# EAGLE design Cansat2019_1516_Payload_SectionA_v04 (EAGLE 7.3.0)
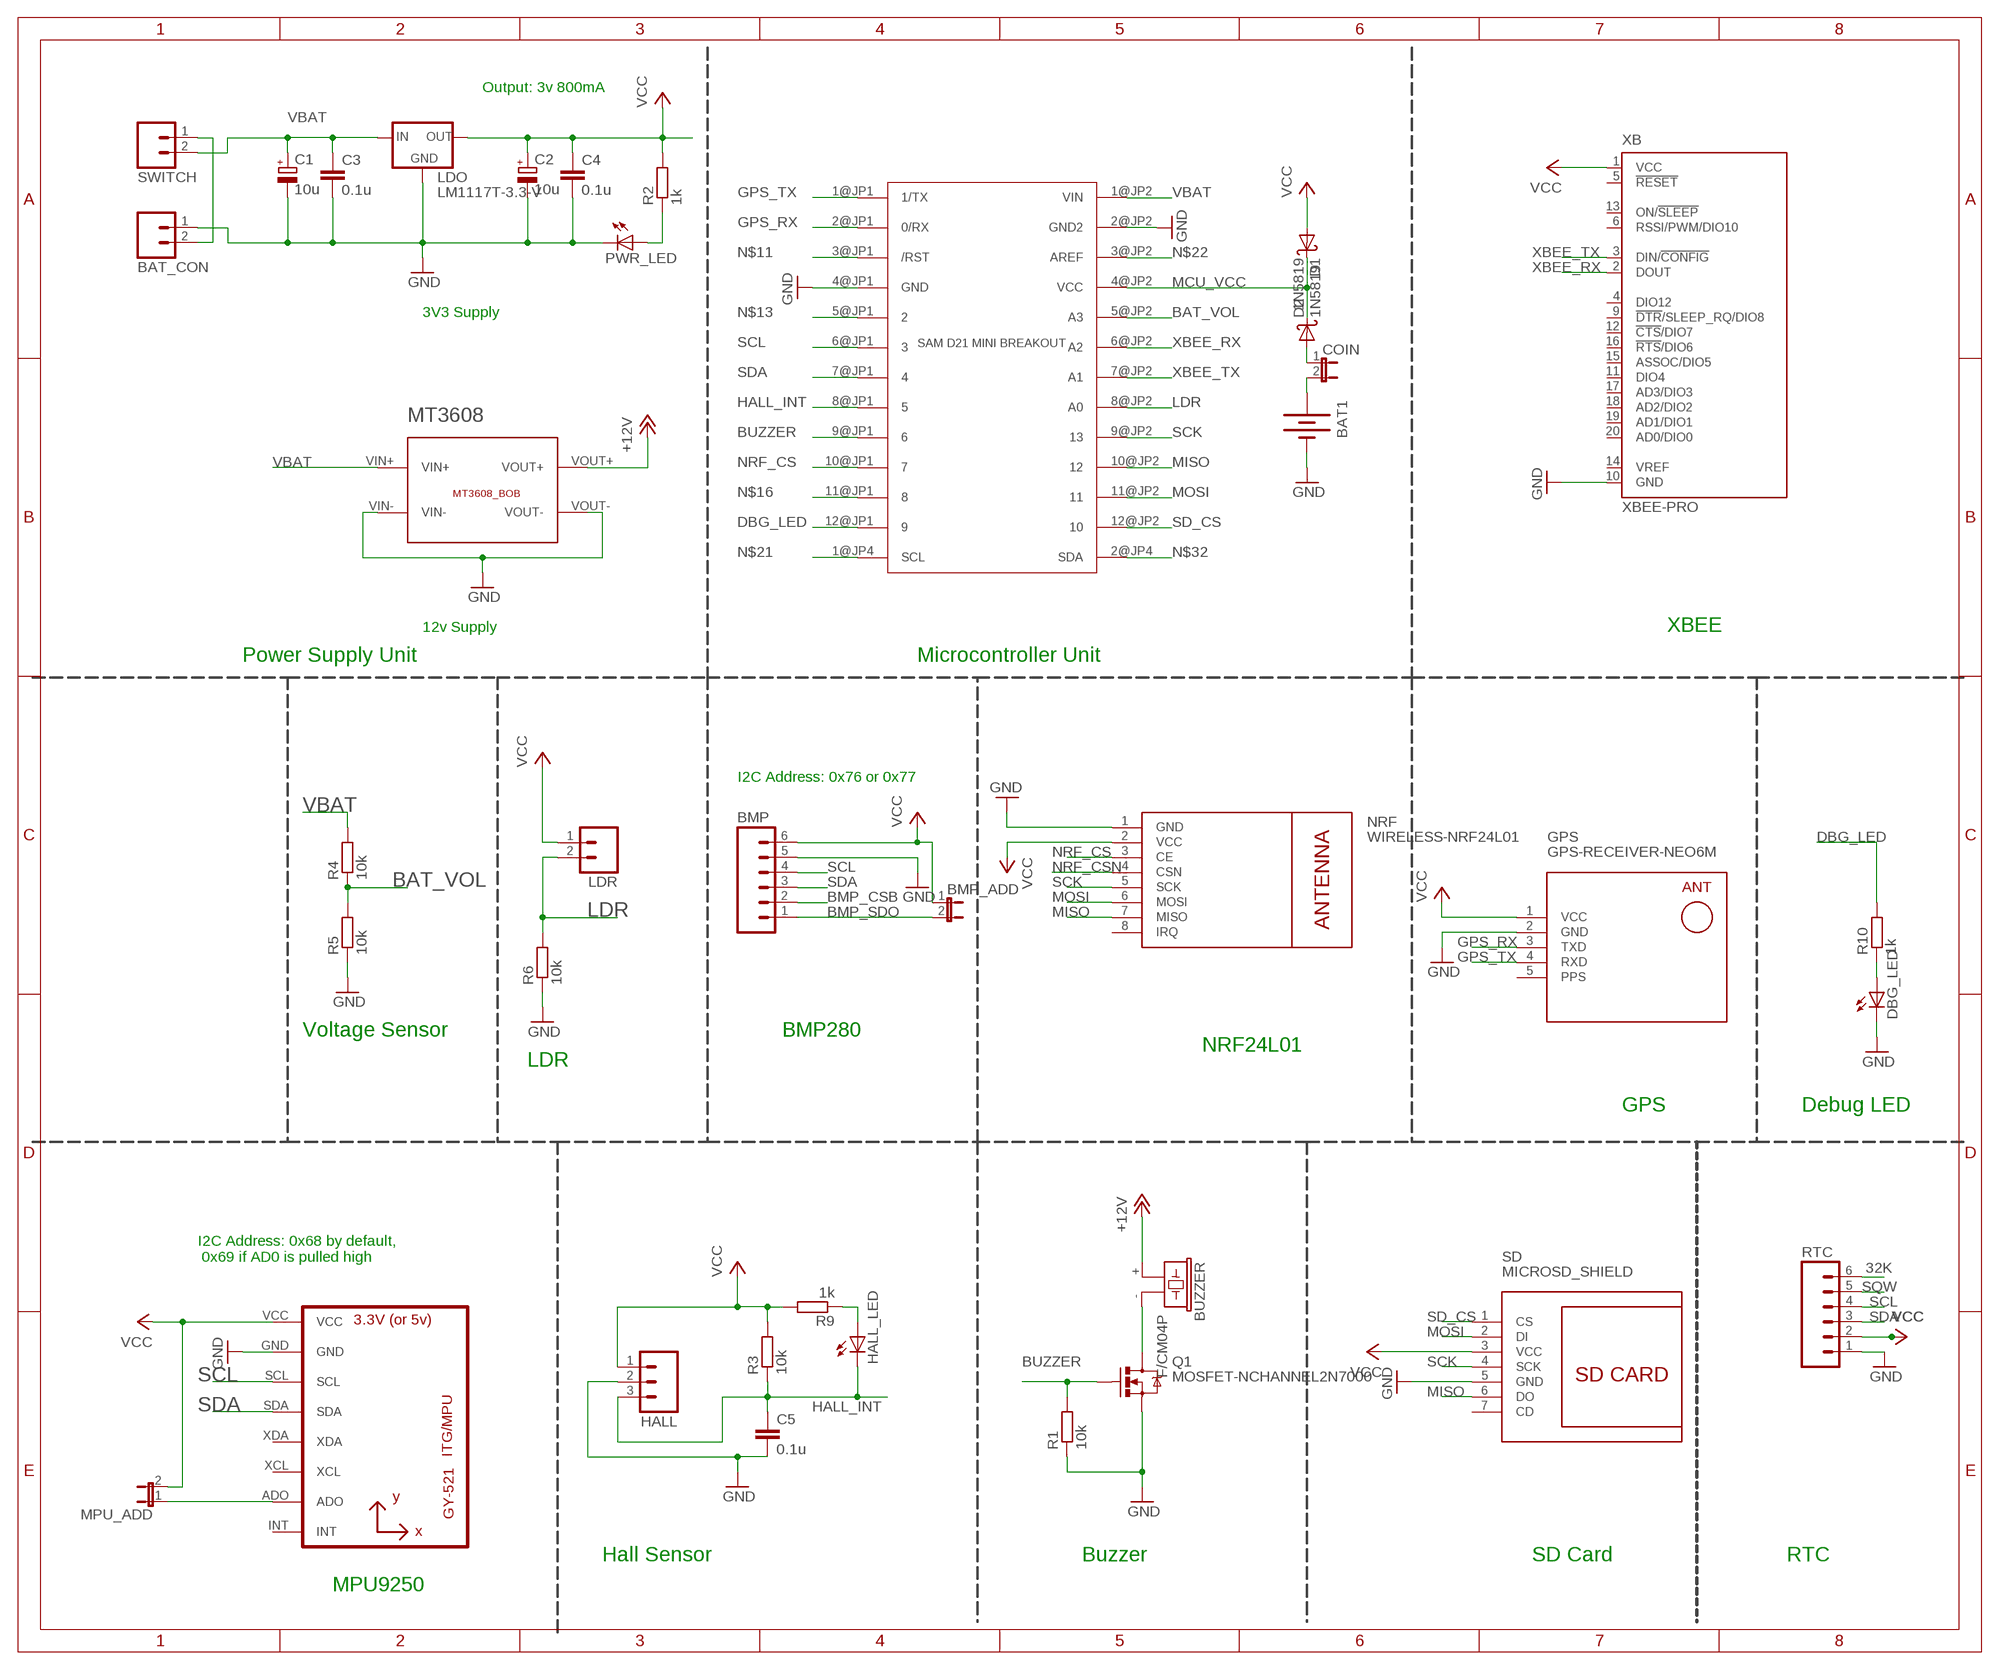
[diagram p0: schematic, sheet 1]

## Parts
BAT1  BATTERY20PTH  [BATTCOM_20MM_PTH]
BAT_CON  M02  [02P]
BMP  M06  [06P]
BMP_ADD  JUMPER-2PTH  [1X02]
BUZZER  F/CM04P  [F/CM04P]
C1  10u  CPOL-EUE2.5-6  [E2,5-6]
C2  10u  CPOL-EUE2.5-6  [E2,5-6]
C3  0.1u  C-EU025-025X050  [C025-025X050]
C4  0.1u  C-EU025-025X050  [C025-025X050]
C5  0.1u  C-EU025-025X050  [C025-025X050]
COIN  JUMPER-2PTH  [1X02]
D1  1N5819  [DO41-10]
D2  1N5819  [DO41-10]
DBG_LED  LED3MM  [LED3MM]
GPS  GPS-RECEIVER-NEO6M  [GPS-RECEIVER-NEO6M]
HALL  M03  [03P]
HALL_LED  LED3MM  [LED3MM]
LDO  LM1117T-3.3-V  [TO220V]
LDR  M02  [02P]
MPU  GY-521MPU6050  [GY-521]
MPU_ADD  JUMPER-2PTH  [1X02]
MT3608  MT3608_BOB  [MT3608_BOB]
NRF  WIRELESS-NRF24L01  [WIRELESS-NRF24L01]
PWR_LED  LED3MM  [LED3MM]
Q1  MOSFET-NCHANNEL2N7000  [TO-92]
R1  10k  R-EU_0204/7  [0204/7]
R2  1k  R-EU_0204/7  [0204/7]
R3  10k  R-EU_0204/7  [0204/7]
R4  10k  R-EU_0204/7  [0204/7]
R5  10k  R-EU_0204/7  [0204/7]
R6  10k  R-EU_0204/7  [0204/7]
R9  1k  R-EU_0204/7  [0204/7]
R10  1k  R-EU_0204/7  [0204/7]
RTC  M06  [06P]
SAMD  SAM_D21_MINI_BREAKOUT  [JP1_SPARKFUN-SAMD21-MINI-BREAKOUT-V10]
SD  MICROSD_SHIELD  [MICROSD_SHIELD]
SWITCH  M02  [02P]
XB  XBEE-PRO  [XBEE-PRO]

## Nets
32K: RTC.6
+12V [power]: BUZZER.+ MT3608.VOUT+
BAT_VOL: R4.1 R5.2 SAMD.5@JP2(A3)
BMP_CSB: BMP.2
BMP_SDO: BMP.1 BMP_ADD.2
BUZZER: Q1.2(G) R1.2 SAMD.9@JP1
DBG_LED: R10.2 SAMD.12@JP1
GND [power]: BAT1.2(-) BAT_CON.1 BMP.5 C1.- C2.- C3.2 C4.2 C5.2 DBG_LED.K(C) GPS.2(GND) HALL.2 LDO.1(GND) MPU.GND MT3608.VIN- MT3608.VOUT- NRF.1(GND) PWR_LED.K(C) Q1.1(S) R1.1 R5.1 R6.1 RTC.1 SAMD.2@JP2(GND2) SAMD.4@JP1(GND) SD.5(GND) XB.10(GND)
GPS_RX: GPS.3(TXD) SAMD.2@JP1(0/RX)
GPS_TX: GPS.4(RXD) SAMD.1@JP1(1/TX)
HALL_INT: C5.1 HALL.3 HALL_LED.K(C) R3.1 SAMD.8@JP1
LDR: LDR.2 R6.2 SAMD.8@JP2(A0)
MCU_VCC [power]: D1.C D2.C SAMD.4@JP2(VCC)
MISO: NRF.7(MISO) SAMD.10@JP2 SD.6(DO)
MOSI: NRF.6(MOSI) SAMD.11@JP2 SD.2(DI)
N$1: BUZZER.- Q1.3(D)
N$2 [power]: COIN.1 D2.A
N$3: PWR_LED.A R2.1
N$5 [power]: BAT1.1(+) COIN.2
N$6 [power]: BAT_CON.2 SWITCH.1
N$9: MPU.ADO MPU_ADD.1
N$11: SAMD.3@JP1(/RST)
N$13: SAMD.5@JP1
N$14: HALL_LED.A R9.1
N$15: DBG_LED.A R10.1
N$16: SAMD.11@JP1
N$21: SAMD.1@JP4(SCL)
N$22: SAMD.3@JP2(AREF)
N$32: SAMD.2@JP4(SDA)
NRF_CS: NRF.3(CE) SAMD.10@JP1
NRF_CSN: NRF.4(CSN)
SCK: NRF.5(SCK) SAMD.9@JP2 SD.4(SCK)
SCL: BMP.4 MPU.SCL RTC.4 SAMD.6@JP1
SD_CS: SAMD.12@JP2 SD.1(CS)
SDA: BMP.3 MPU.SDA RTC.3 SAMD.7@JP1
SQW: RTC.5
VBAT [power]: C1.+ C3.1 LDO.3(IN) MT3608.VIN+ R4.2 SAMD.1@JP2(VIN) SWITCH.2
VCC [power]: BMP.6 BMP_ADD.1 C2.+ C4.1 D1.A GPS.1(VCC) HALL.1 LDO.2(OUT) LDR.1 MPU.VCC MPU_ADD.2 NRF.2(VCC) R2.2 R3.2 R9.2 RTC.2 SD.3(VCC) XB.1(VCC)
XBEE_RX: SAMD.6@JP2(A2) XB.2(DOUT)
XBEE_TX: SAMD.7@JP2(A1) XB.3(DIN/!CONFIG)
Unconnected: MPU.INT MPU.XCL MPU.XDA NRF.8(IRQ) SD.7(CD) XB.4(DIO12) XB.5(!RESET) XB.6(RSSI/PWM/DIO10) XB.9(!DTR!/SLEEP_RQ/DIO8) XB.11(DIO4) XB.12(!CTS!/DIO7) XB.13(ON/!SLEEP) XB.14(VREF) XB.15(ASSOC/DIO5) XB.16(!RTS!/DIO6) XB.17(AD3/DIO3) XB.18(AD2/DIO2) XB.19(AD1/DIO1) XB.20(AD0/DIO0)

## Notes on the sheet
- Output: 3v 800mA
- 3V3 Supply
- 12v Supply | XBEE
- Power Supply Unit | Microcontroller Unit
- I2C Address: 0x76 or 0x77
- Voltage Sensor | BMP280
- NRF24L01
- LDR
- GPS | Debug LED
- I2C Address: 0x68 by default,
   0x69 if AD0 is pulled high
- Hall Sensor | Buzzer | SD Card | RTC
- MPU9250

## Power pins joined to a net without a drawn wire
PPS: GPS.5(PPS)

## Library data of the parts
BAT1 = MSP-MB_V12:BATTERY: Battery Holders Various common sizes : AA, AAA, 18650 (PRT-12895), 20mm coin cell and 12mm coin cell. 20MM_4LEGS, BATT-10373
BAT_CON LDR SWITCH = CEDT_JANUARY_2015_v5:M02: AMP QUICK CONNECTOR
BMP RTC = con-amp-quick:M06: AMP QUICK CONNECTOR; OC_FARNELL: unknown; OC_NEWARK: unknown
BMP_ADD COIN MPU_ADD = SparkFun-Retired:JUMPER-2: Jumper Basic 0.1" spaced jumper. Use with breakaway headers.
BUZZER = buzzer:F/CM04P: BUZZER Source: Buerklin; OC_FARNELL: unknown; OC_NEWARK: unknown
C1 C2 = rcl:CPOL-EU: POLARIZED CAPACITOR, European symbol
C3-C5 = rcl:C-EU: CAPACITOR, European symbol
D1 D2 = CEDT_JANUARY_2015_v6 (2):1N5819: DIODE general purpose rectifier, 1 A
DBG_LED HALL_LED PWR_LED = 01_adafruit:LED: LED OSRAM: - CHIPLED LG R971, LG N971, LY N971, LG Q971, LY Q971, LO R971, LY R971 LH N974, LH R974 LS Q976, LO Q976, LY Q976 LO Q996 - Hyper CHIPLED LW Q18S LB Q993, LB Q99A, LB R99A - SideLED LS A670, LO A670, LY A670, LG A670, LP A670 LB A673, LV A673, LT A673, LW A673 LH A674 LY A675 LS A676, LA A676, LO A676, LY A676, LW A676 LS A679, LY A679, LG A679 - Hyper Micro SIDELED® LS Y876, LA Y876, LO Y876, LY Y876 LT Y87S - SmartLED LW L88C, LW L88S LB L89C, LB L89S, LG L890 LS L89K, LO L89K, LY L89K LS L896, LA L896, LO L896, LY L896 - TOPLED LS T670, LO T670, LY T670, LG T670, LP T670 LSG T670, LSP T670, LSY T670, LOP T670, LYG T670 LG T671, LOG T671, LSG T671 LB T673, LV T673, LT T673, LW T673 LH T674 LS T676, LA T676, LO T676, LY T676, LB T676, LH T676, LSB T676, LW T676 LB T67C, LV T67C, LT T67C, LS T67K, LO T67K, LY T67K, LW E67C LS E67B, LA E67B, LO E67B, LY E67B, LB E67C, LV E67C, LT E67C LW T67C LS T679, LY T679, LG T679 LS T770, LO T770, LY T770, LG T770, LP T770 LB T773, LV T773, LT T773, LW T773 LH T774 LS E675, LA E675, LY E675, LS T675 LS T776, LA T776, LO T776, LY T776, LB T776 LHGB T686 LT T68C, LB T68C - Hyper Mini TOPLED® LB M676 - Mini TOPLED Santana® LG M470 LS M47K, LO M47K, LY M47K Source: http://www.osram.convergy.de/
GPS = diy-modules:GPS-RECEIVER-NEO6M: GPS Receiver Module based on NEO-6 device Short tutorial how to use NEO-6 module with Arduino: http://www.xarg.org/2016/06/neo6mv2-gps-module-with-arduino/ NEO-6 datasheet is available here: https://www.u-blox.com/sites/default/files/products/documents/NEO-6_DataSheet_%28GPS.G6-HW-09005%29.pdf Click here to find device on ebay.com <http://www.ebay.com/sch/gyneo6mv2>
HALL = msp framework:M03: AMP QUICK CONNECTOR
LDO = lm1117:LM1117T-*
MPU = gy-521:GY-521
MT3608 = Breakouts:MT3608_BOB
NRF = diy-modules:WIRELESS-NRF24L01: 2.4 GHz Wireless Module based on NRF24L01 chip More details available here: http://www.electrodragon.com/w/NRF24L01 Click here to find device on ebay.com <http://www.ebay.com/sch/nrf24l01+arduino>
Q1 = SparkFun-DiscreteSemi:MOSFET-NCHANNEL: Common NMOSFET Parts MFG P/N Store ID Prod ID FDD8780 TRANS-09984 SI7820DN TRANS-11055 FDS6630A IC-08089 2N7002PW TRANS-11151 FQP30N06L COM-10213 TRANS-10060 BSS123LT1G TRANS-08345 BSS138 TRANS-00830 BS170 2N7000
R1-R6 R9 R10 = rcl:R-EU_: RESISTOR, European symbol
SAMD = SparkFun-SAMD21-Mini-Breakout:SAM_D21_MINI_BREAKOUT: SPARKFUN-SAMD21-MINI-BREAKOUT
SD = Breakouts:MICROSD_SHIELD
XB = xbee:XBEE: XBee (TM) /XBee-PRO(TM) OEM RF Modules Source: MaxStream, Inc. xbee_productmanual.pdf; MPN: XBP24-AWI-001; OC_FARNELL: 1337916; OC_NEWARK: 42M2667

## Net classes
0 default: width 0.305 mm
1 power: width 0.61 mm, clearance 0.305 mm

## Board
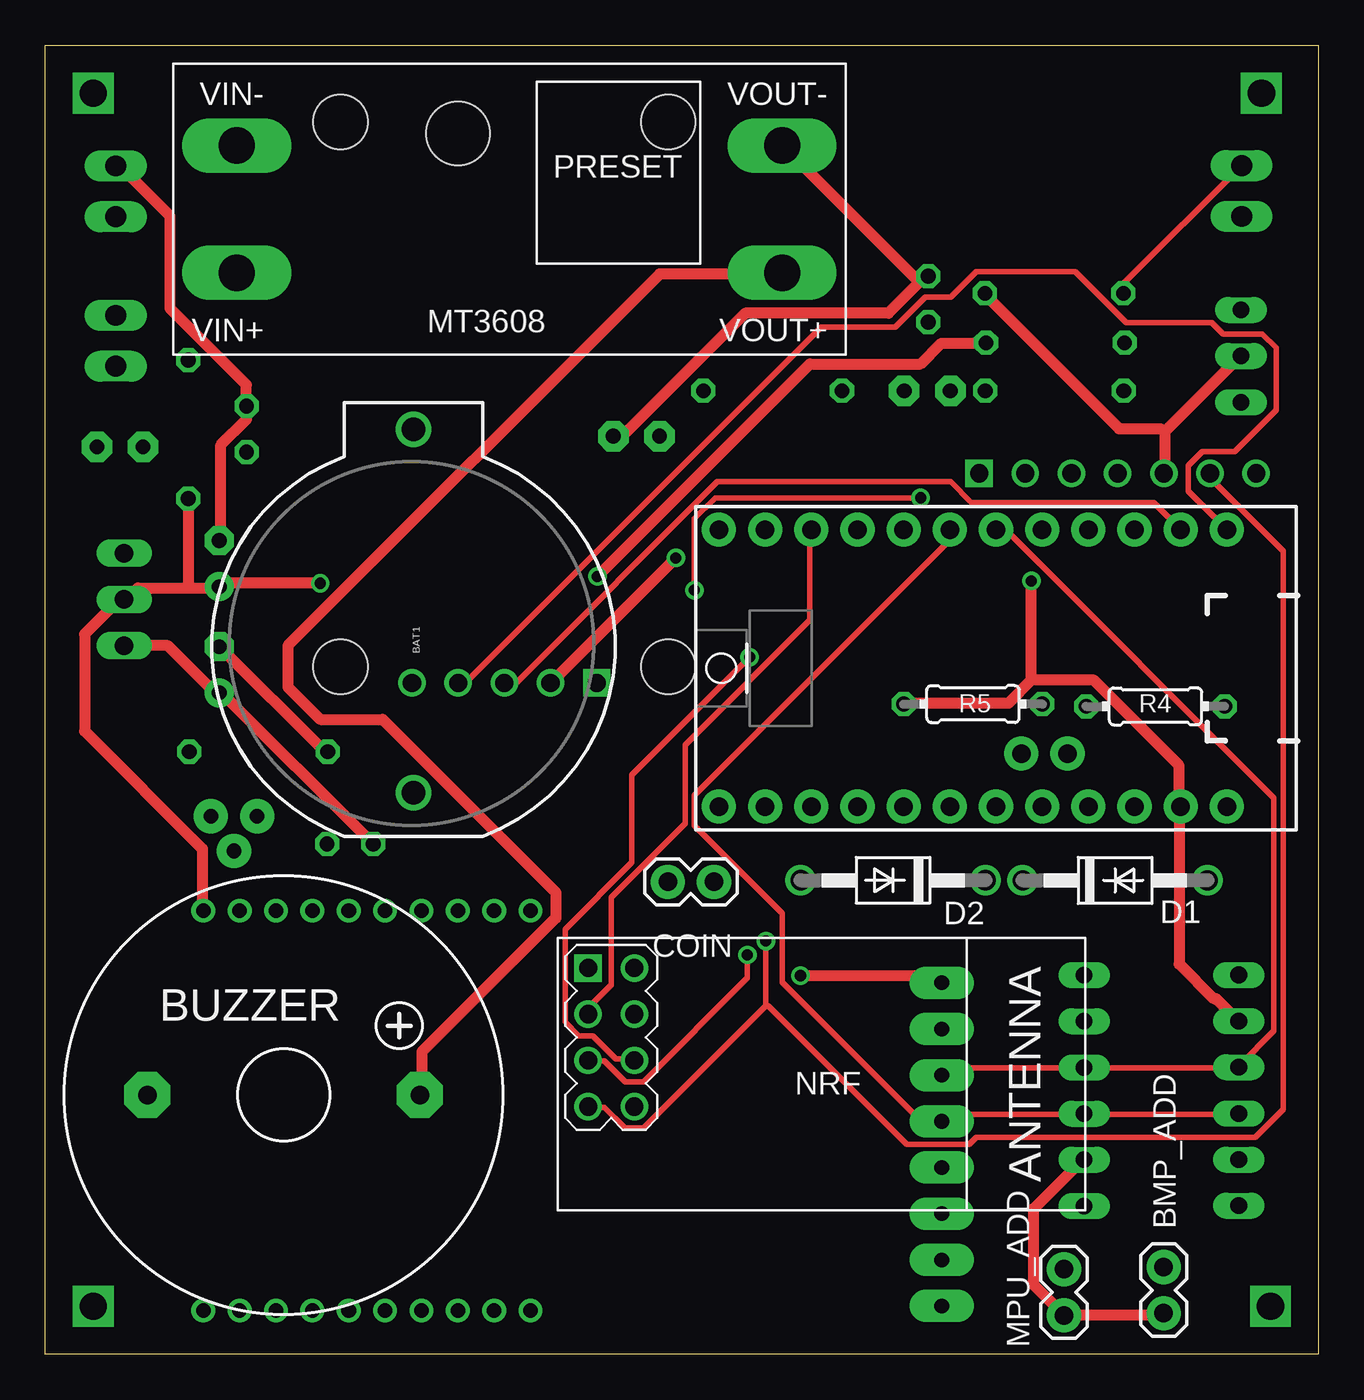
[diagram p1: board, top side]
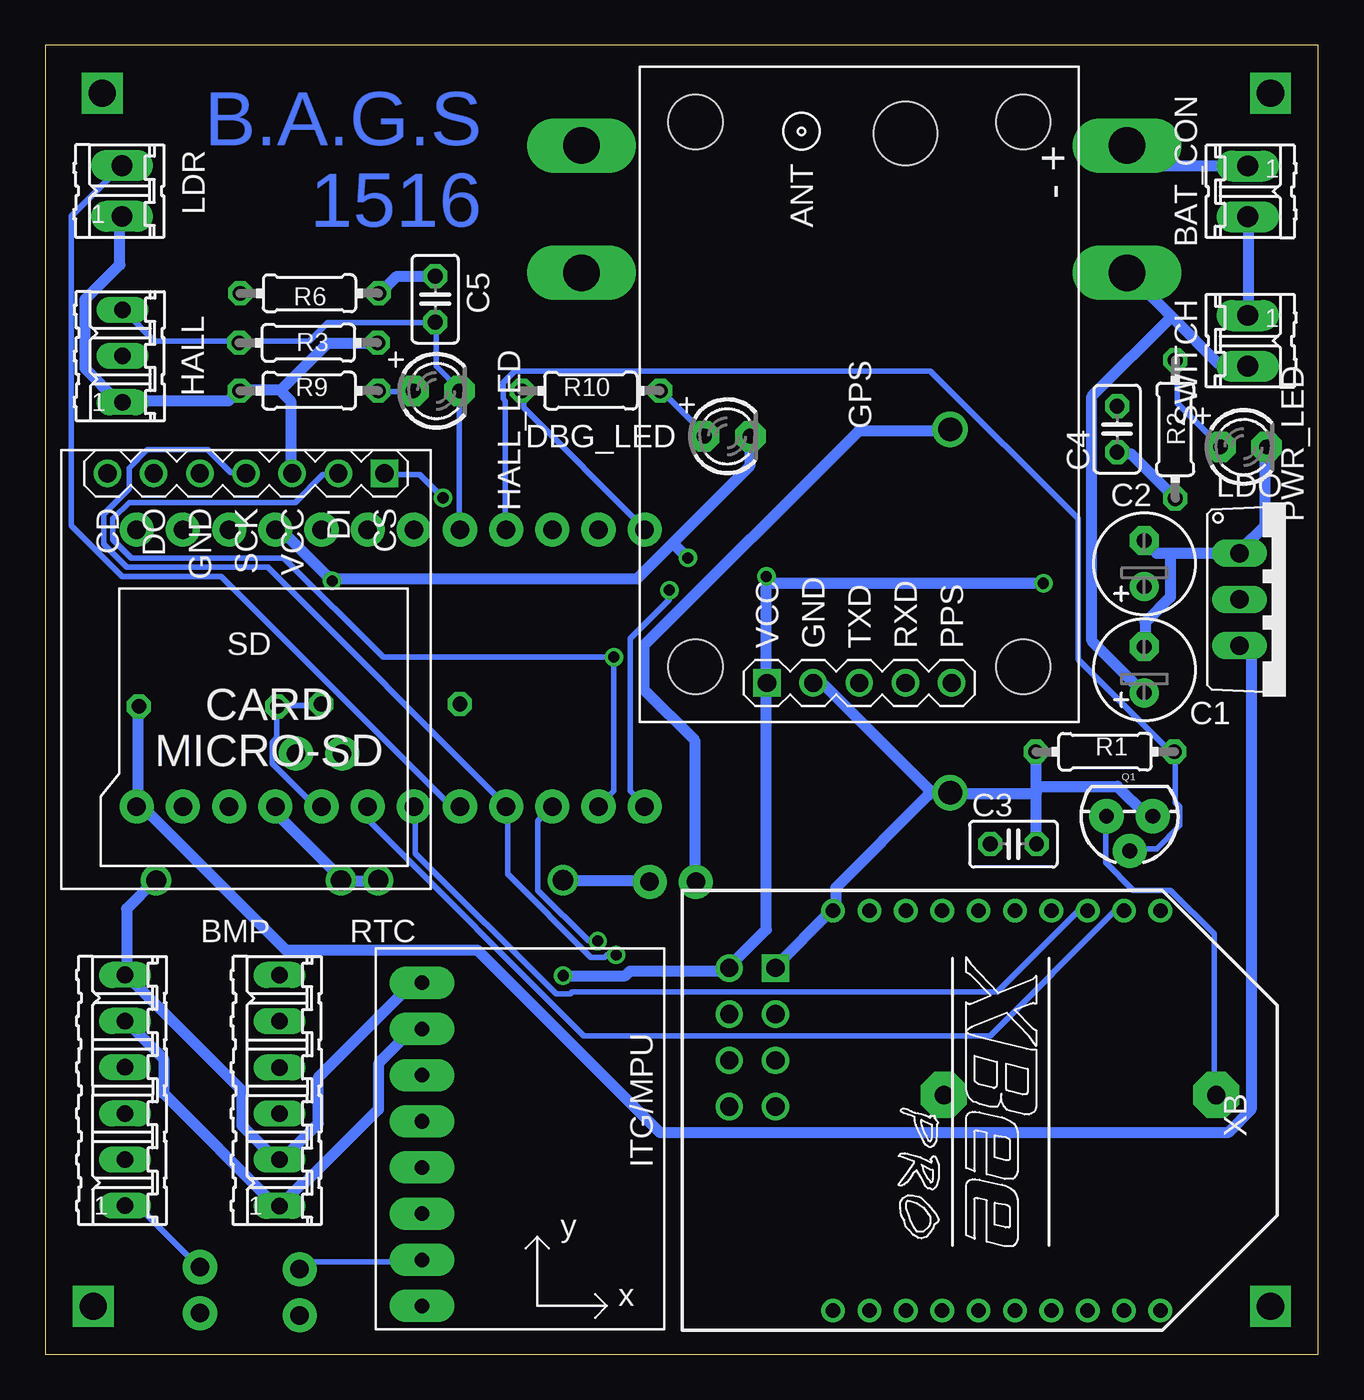
[diagram p2: board, bottom side, seen from below]

Size 70 x 72 mm. Coordinates in mm from the lower left corner, seen from the top.
Outline: 70,0 0,0 0,72 70,72 70,0
Copper layers (1*16): Top 0.035mm / dielectric 1.5mm / Bottom 0.035mm
Design rules "default": minimum track width 10mil, minimum drill 24mil, track to track 8mil, track to pad 8mil, pad to pad 8mil, via to via 8mil, smd to smd 8mil, copper to edge 40mil, drill to drill 8mil, minimum pad ring 10mil, minimum via ring 8mil, stop-mask expansion 4mil, vias tented up to drill 0mil, thermal gap 10mil

### Footprints (pad centres in the part's own frame; a part is rotated, then mirrored left to right if it is on the bottom)
BATTCOM_20MM_PTH = drill 1.3: 1 11.85,0; 2 -8.15,0
02P = drill 1.143 long: 1 -1.397,0; 2 1.397,0
06P = drill 0.914 long: 1 -6.35,0; 2 -3.81,0; 3 -1.27,0; 4 1.27,0; 5 3.81,0; 6 6.35,0
1X02 = drill 1.016 pad 1.88: 1 0,0; 2 2.54,0
F/CM04P = drill 1.016 pad 2.54 octagon: + 7.493,0; - -7.493,0
E2,5-6 = drill 0.813 pad 1.6: + -1.27,0 | drill 0.813 pad 1.6 octagon: - 1.27,0
C025-025X050 = drill 0.813 octagon: 1 -1.27,0; 2 1.27,0
DO41-10 = drill 1.118: A 5.08,0; C -5.08,0
LED3MM = drill 0.813 pad 1.676 octagon: A -1.27,0; K 1.27,0
GPS-RECEIVER-NEO6M = drill 1 square: 1 -15.875,5.08 | drill 1: 2 -15.875,2.54; 3 -15.875,0; 4 -15.875,-2.54; 5 -15.875,-5.08 | hole 3: -14.986,9.017; -14.986,-9.017; 14.986,-9.017; 14.986,9.017 | hole 3.5: 14.351,-2.54
03P = drill 0.914 long: 1 -2.54,0; 2 0,0; 3 2.54,0
TO220V = drill 1.016 long: 1 -2.54,-2.54; 2 0,-2.54; 3 2.54,-2.54
GY-521 = drill 0.8 pad 1.778 long: ADO -8.89,-6.35; GND -8.89,6.35; INT -8.89,-8.89; SCL -8.89,3.81; SDA -8.89,1.27; VCC -8.89,8.89; XCL -8.89,-3.81; XDA -8.89,-1.27
MT3608_BOB = drill 2 pad 3 long: VIN+ 33.5,-4.5; VIN- 33.5,-11.5; VOUT+ 3.5,-4.5; VOUT- 3.5,-11.5
WIRELESS-NRF24L01 = drill 1 square: 1 -12.7,6.35 | drill 1: 2 -10.16,6.35; 3 -12.7,3.81; 4 -10.16,3.81; 5 -12.7,1.27; 6 -10.16,1.27; 7 -12.7,-1.27; 8 -10.16,-1.27
TO-92 = drill 0.813 pad 1.88: 1 -1.27,0; 2 0,1.905; 3 1.27,0
0204/7 = drill 0.813 octagon: 1 -3.81,0; 2 3.81,0
JP1_SPARKFUN-SAMD21-MINI-BREAKOUT-V10 = drill 1.016 pad 1.88: 1@JP1 1.27,29.21; 1@JP2 16.51,29.21; 1@JP4 13.589,20.447; 2@JP1 1.27,26.67; 2@JP2 16.51,26.67; 2@JP4 13.589,17.907; 3@JP1 1.27,24.13; 3@JP2 16.51,24.13; 4@JP1 1.27,21.59; 4@JP2 16.51,21.59; 5@JP1 1.27,19.05; 5@JP2 16.51,19.05; 6@JP1 1.27,16.51; 6@JP2 16.51,16.51; 7@JP1 1.27,13.97; 7@JP2 16.51,13.97; 8@JP1 1.27,11.43; 8@JP2 16.51,11.43; 9@JP1 1.27,8.89; 9@JP2 16.51,8.89; 10@JP1 1.27,6.35; 10@JP2 16.51,6.35; 11@JP1 1.27,3.81; 11@JP2 16.51,3.81; 12@JP1 1.27,1.27; 12@JP2 16.51,1.27
MICROSD_SHIELD = drill 1 square: 1 1.27,17.78 | drill 1: 2 1.27,15.24; 3 1.27,12.7; 4 1.27,10.16; 5 1.27,7.62; 6 1.27,5.08; 7 1.27,2.54
XBEE-PRO = drill 0.8 pad 1.27: 1 -11,9; 2 -11,7; 3 -11,5; 4 -11,3; 5 -11,1; 6 -11,-1; 7 -11,-3; 8 -11,-5; 9 -11,-7; 10 -11,-9; 11 11,-9; 12 11,-7; 13 11,-5; 14 11,-3; 15 11,-1; 16 11,1; 17 11,3; 18 11,5; 19 11,7; 20 11,9

### Placement (x,y rotation side)
BAT1  20.24,39.03 90 top
BAT_CON  3.87,63.97 270 bottom
BMP  65.63,14.51 90 bottom
BMP_ADD  61.5,2.25 90 top
BUZZER  13.1,14.26 0 top
C1  9.56,37.65 90 bottom
C2  9.56,43.49 90 bottom
C3  16.76,28.06 0 bottom
C4  11.06,50.89 90 bottom
C5  48.56,58.04 90 bottom
COIN  36.77,25.98 180 top
D1  58.83,26.06 0 top
D2  46.62,26.07 180 top
DBG_LED  32.5,50.5 0 bottom
GPS  25.24,52.8 90 bottom
HALL  65.75,54.91 90 bottom
HALL_LED  48.5,53 0 bottom
LDO  1.79,41.52 270 bottom
LDR  65.79,63.99 90 bottom
MPU  40.41,11.54 0 bottom
MPU_ADD  56.02,4.67 270 top
MT3608  44.02,54.99 180 top
NRF  42.55,14.89 0 top
PWR_LED  4.1,49.91 0 bottom
Q1  10.37,29.59 180 bottom
R1  11.72,33.14 0 bottom
R2  7.86,50.88 270 bottom
R3  55.54,55.64 0 bottom
R4  61.05,35.64 0 top
R5  51.02,35.77 0 top
R6  55.48,58.36 180 bottom
R9  55.5,53 180 bottom
R10  40,53 180 bottom
RTC  57.13,14.5 90 bottom
SAMD  35.77,46.63 270 top
SD  69.13,49.73 270 bottom
SWITCH  3.87,55.75 270 bottom
XB  17.68,13.4 270 bottom

### Tracks (layer width: path | path; a pad name or v marks a point on that pad's centre or on a via)
+12V
  Top 0.61: BUZZER.+ 20.7,14.34 20.7,16.63 28.07,23.99 28.07,25.39 18.54,34.92 15.11,34.92 13.34,36.69 13.34,38.98 33.78,59.43 40.51,59.43 MT3608.VOUT+
BAT_VOL
  Bottom 0.305: R5.2 54.86,35.68 57.15,35.68 R4.1 57.28,35.55 57.28,33.9 57.53,33.65 57.53,32.5 55.24,30.22 54.86,30.22 SAMD.5@JP2
BMP_SDO
  Bottom 0.305: BMP.1 65.53,8.12 64.9,8.12 61.59,4.82 BMP_ADD.2
BUZZER
  Bottom 0.305: Q1.2 10.29,27.8 8.89,27.8 7.62,29.07 7.62,30.09 7.87,30.34 7.87,33.14 R1.2 8,33.01 13.21,38.22 13.21,45.97 21.34,54.09 44.2,54.09 44.83,53.46 44.83,52.57 44.7,52.44 44.7,45.46 SAMD.9@JP1
DBG_LED
  Bottom 0.305: R10.2 43.69,52.95 43.69,52.06 37.08,45.46 SAMD.12@JP1
GND  (via drill 0.61)
  Top 0.61: C2.- 9.65,44.82 9.65,50.03 11.05,51.43 11.05,52.06 C4.2 11.05,52.44 11.05,53.33 6.86,57.52 6.86,62.6 4.19,65.27 3.94,65.27 BAT_CON.1 | R1.1 15.49,33.27 15.24,33.27 9.65,38.85 C1.- | 61.59,50.79 65.66,54.85 HALL.2 | 61.59,50.79 61.59,48.51 SD.5 | 48.07,58.98 48.51,59.43 C5.2 | 48.07,58.98 46.35,57.27 38.48,57.27 31.75,50.54 31.24,50.54 DBG_LED.K | 48.07,58.98 40.64,66.41 MT3608.VOUT- | 61.59,50.79 61.34,50.92 59.05,50.92 51.69,58.28 R6.1 | 54.23,37.08 52.96,35.8 47.24,35.8 R5.1 | 54.23,37.08 57.66,37.08 62.36,32.38 62.36,30.22 SAMD.2@JP2 62.36,29.84 62.36,21.45 64.26,19.55 64.39,19.55 65.53,18.41 BMP.5 | 54.23,37.08 v54.23,42.54 | v34.67,43.81 27.81,36.95 GPS.2
  Bottom 0.61: 15.49,30.85 15.49,28.18 C3.2 | 15.49,30.85 15.49,31.23 | 15.49,31.23 15.49,33.14 R1.1 | 15.49,31.23 11.05,31.23 9.53,29.71 9.14,29.71 Q1.1 | NRF.1 29.84,21.33 26.8,24.38 XB.10 26.54,24.63 26.54,25.64 21.46,30.73 21.34,30.98 | 21.34,30.98 27.18,36.82 27.69,36.82 GPS.2 | 21.34,30.98 20.32,30.98 BAT1.2 19.94,30.85 15.49,30.85 | BAT_CON.1 3.94,65.4 9.4,65.4 10.41,66.41 MT3608.VIN- | 8.13,44.06 8.89,44.06 9.53,44.7 C2.- | 8.13,44.06 LDO.1 4.19,44.31 2.92,45.58 2.92,49.9 PWR_LED.K | 8.13,44.06 8.13,41.65 9.53,40.25 9.53,38.98 C1.- | C5.2 48.64,59.3 50.67,59.3 51.56,58.41 R6.1 | MPU.GND 49.4,17.77 49.91,17.77 51.69,15.99 51.69,13.45 55.75,9.39 55.88,9.39 57.02,8.25 RTC.1 57.4,8.25 63.5,14.34 63.5,16.25 65.53,18.28 BMP.5 | SAMD.4@JP1 57.28,45.33 57.02,45.33 v54.23,42.54 53.98,42.66 37.47,42.66 35.5,44.63 | 35.5,44.63 31.24,48.89 31.24,50.41 DBG_LED.K | 35.5,44.63 v34.67,43.81
GPS_RX
  Top 0.305: GPS.3 25.27,36.95 25.91,36.95 36.96,48 49.78,48 50.93,46.85 60.96,46.85 62.36,45.46 SAMD.2@JP1
GPS_TX
  Top 0.305: GPS.4 22.73,36.95 23.11,36.95 42.67,56.51 46.74,56.51 48.39,58.16 49.78,58.16 51.18,59.55 56.64,59.55 59.44,56.76 64.13,56.76 64.77,56.12 66.93,56.12 67.69,55.36 67.69,51.93 65.41,49.65 63.63,49.65 62.87,48.89 62.87,47.49 64.9,45.46 SAMD.1@JP1
HALL_INT
  Bottom 0.305: HALL.3 65.66,57.4 64.01,55.74 59.44,55.74 R3.1 59.31,55.74 55.5,55.74 54.48,56.76 48.64,56.76 C5.1 48.51,56.76 48.51,54.35 47.24,53.08 HALL_LED.K 47.24,52.95 47.24,45.46 SAMD.8@JP1
LDR
  Top 0.305: R6.2 59.31,58.41 59.31,58.92 LDR.2
  Bottom 0.305: SAMD.8@JP2 47.24,30.22 47.75,30.22 60.33,42.79 65.79,42.79 68.58,45.58 68.58,62.6 65.91,65.27 LDR.2
MCU_VCC
  Bottom 0.61: D2.C 51.82,26.03 53.72,26.03 D1.C 53.85,26.28 57.28,29.71 57.28,30.09 SAMD.4@JP2
MISO  (via drill 0.61)
  Top 0.305: 39.62,19.17 32.89,12.44 31.88,12.44 30.73,13.58 29.97,13.58 NRF.7 | v39.62,22.72 39.62,19.17 | SD.6 64.13,48.38 64.13,48.12 68.07,44.19 68.07,13.45 66.55,11.93 51.18,11.93 50.8,11.55 47.37,11.55 39.75,19.17 39.62,19.17
  Bottom 0.305: v39.62,22.72 40.13,22.72 42.93,25.52 42.93,29.33 42.16,30.09 SAMD.10@JP2
MOSI  (via drill 0.61)
  Top 0.305: v38.73,38.34 32.26,31.87 32.26,27.04 28.57,23.36 28.57,18.28 29.34,17.52 30.1,17.52 31.37,16.25 32.39,16.25 NRF.6
  Bottom 0.305: SAMD.11@JP2 39.5,30.22 38.73,30.98 v38.73,38.34 51.44,38.34 56.9,43.81 65.28,43.81 66.29,44.82 66.29,45.97 65.41,46.85 56.26,46.85 54.74,48.38 53.98,48.38 SD.2
N$1
  Bottom 0.305: Q1.3 11.68,29.58 11.68,27.04 10.16,25.52 8.13,25.52 5.71,23.11 5.71,14.34 BUZZER.-
N$2
  Bottom 0.61: D2.A 41.53,26.03 36.83,26.03 COIN.1
N$3
  Bottom 0.305: R2.1 7.75,54.6 7.75,52.31 5.46,50.03 PWR_LED.A
N$4  (via drill 1.5)
  other vias: 2.62,69.38
N$5
  Bottom 0.61: COIN.2 34.29,26.03 34.29,33.77 37.08,36.57 37.08,38.98 25.27,50.79 20.32,50.79 BAT1.1
N$6
  Bottom 0.61: BAT_CON.2 3.81,62.47 3.81,57.27 SWITCH.1
N$7  (via drill 1.5)
  other vias: 2.62,2.62
N$8  (via drill 1.5)
  other vias: 67.38,2.62
N$9
  Bottom 0.305: MPU.ADO 49.4,5.07 55.63,5.07 56.01,4.69 MPU_ADD.1
N$10  (via drill 1.5)
  other vias: 66.88,69.38
N$14
  Bottom 0.305: R9.1 51.69,52.95 49.78,52.95 HALL_LED.A
N$15
  Bottom 0.305: R10.1 36.07,52.95 33.66,50.54 DBG_LED.A
NRF_CS
  Top 0.305: NRF.3 29.97,18.79 29.97,19.17 31.11,20.31 31.11,25.14 35.18,29.2 35.18,33.52 42.04,40.38 42.04,45.33 SAMD.10@JP1
SCK  (via drill 0.61)
  Top 0.305: v38.61,21.96 38.61,20.69 32.89,14.98 31.88,14.98 30.73,16.12 29.97,16.12 NRF.5
  Bottom 0.305: SD.4 59.05,48.51 59.82,48.51 61.09,49.77 64.39,49.77 65.41,48.76 65.41,47.62 66.8,46.22 66.8,44.57 65.53,43.3 57.78,43.3 44.7,30.22 SAMD.9@JP2 44.58,30.09 44.58,26.41 40.01,21.84 39.24,21.84 39.12,21.96 v38.61,21.96
SCL
  Top 0.305: MPU.SCL 49.4,15.36 49.78,15.74 57.02,15.74 RTC.4 57.28,15.74 65.53,15.74 BMP.4 65.66,15.87 67.56,17.77 67.56,30.6 52.83,45.33 52.32,45.33 SAMD.6@JP1
SD_CS  (via drill 0.61)
  Top 0.305: v48.13,47.11 36.83,47.11 35.69,45.97 v35.69,42.03
  Bottom 0.305: v48.13,47.11 49.4,48.38 51.31,48.38 SD.1 | v35.69,42.03 35.69,41.52 37.85,39.36 37.85,30.98 37.08,30.22 SAMD.12@JP2
SDA
  Top 0.305: BMP.3 65.53,13.2 57.28,13.2 RTC.3 57.02,13.2 49.78,13.2 49.4,12.82 MPU.SDA 49.15,12.82 48.13,12.82 40.51,20.44 40.51,24.25 35.69,29.07 35.69,30.73 49.66,44.7 49.66,45.33 SAMD.7@JP1
VBAT
  Top 0.61: C3.1 17.91,28.18 9.65,36.44 C1.+ 9.27,36.44 6.73,38.98 LDO.3
  Bottom 0.61: 8.06,57.08 10.41,59.43 MT3608.VIN+ | 8.06,57.08 5.46,54.47 3.94,54.47 SWITCH.2 | R4.2 64.9,35.55 64.9,30.22 SAMD.1@JP2 64.64,30.09 56.77,22.22 46.23,22.22 36.2,12.18 4.95,12.18 3.68,13.45 3.68,38.34 4.32,38.98 LDO.3 | 8.06,57.08 12.45,52.7 12.45,39.23 9.65,36.44 C1.+
VCC  (via drill 0.61)
  Top 0.61: XB.1 8.64,24.5 8.64,27.8 2.16,34.28 2.16,39.62 4.06,41.52 LDO.2 4.57,41.65 5.08,42.16 7.87,42.16 | 7.87,42.16 9.53,42.16 C2.+ 9.78,42.41 v15.11,42.41 | 7.87,42.16 7.87,46.98 R2.2 | RTC.2 57.02,10.66 54.36,7.99 54.36,3.8 56.01,2.15 MPU_ADD.2 56.26,2.15 61.47,2.15 BMP_ADD.1 | v41.53,20.82 48.9,20.82 49.28,20.44 MPU.VCC | v30.35,42.79 42.04,54.47 48.13,54.47 49.28,55.62 51.69,55.62 R3.2
  Bottom 0.61: C4.1 11.05,49.52 10.29,49.52 7.87,47.11 R2.2 | 57.02,53.08 54.48,55.62 51.82,55.62 R3.2 | 57.02,53.08 59.31,53.08 R9.2 59.56,52.82 59.94,52.44 65.66,52.44 HALL.1 66.04,52.44 67.82,54.22 67.82,58.03 65.91,59.94 65.91,62.47 LDR.1 | SD.3 56.52,48.51 56.52,52.44 56.9,52.82 57.02,53.08 | D1.A 64.01,26.03 65.53,24.5 65.53,20.95 BMP.6 65.41,20.69 59.18,14.47 59.18,12.56 57.4,10.79 RTC.2 57.02,10.66 54.99,12.69 54.99,15.23 49.91,20.31 49.4,20.31 MPU.VCC | v41.53,20.82 38.1,20.82 37.85,21.07 32.64,21.07 NRF.2 32.39,21.33 30.35,23.36 30.35,36.82 GPS.1 30.35,37.2 v30.35,42.79 30.1,42.41 v15.11,42.41
XBEE_RX
  Bottom 0.305: XB.2 10.79,24.38 11.18,24.38 18.03,17.52 40.39,17.52 52.2,29.33 52.2,30.09 SAMD.6@JP2
XBEE_TX
  Bottom 0.305: XB.3 12.7,24.38 13.21,24.38 17.65,19.93 41.02,19.93 41.15,19.8 41.91,19.8 49.66,27.55 49.66,30.09 SAMD.7@JP2

### Text on the board
Bottom: B.A.G.S / 1516
bPlace: - +
bStop: B.A.G.S / 1516